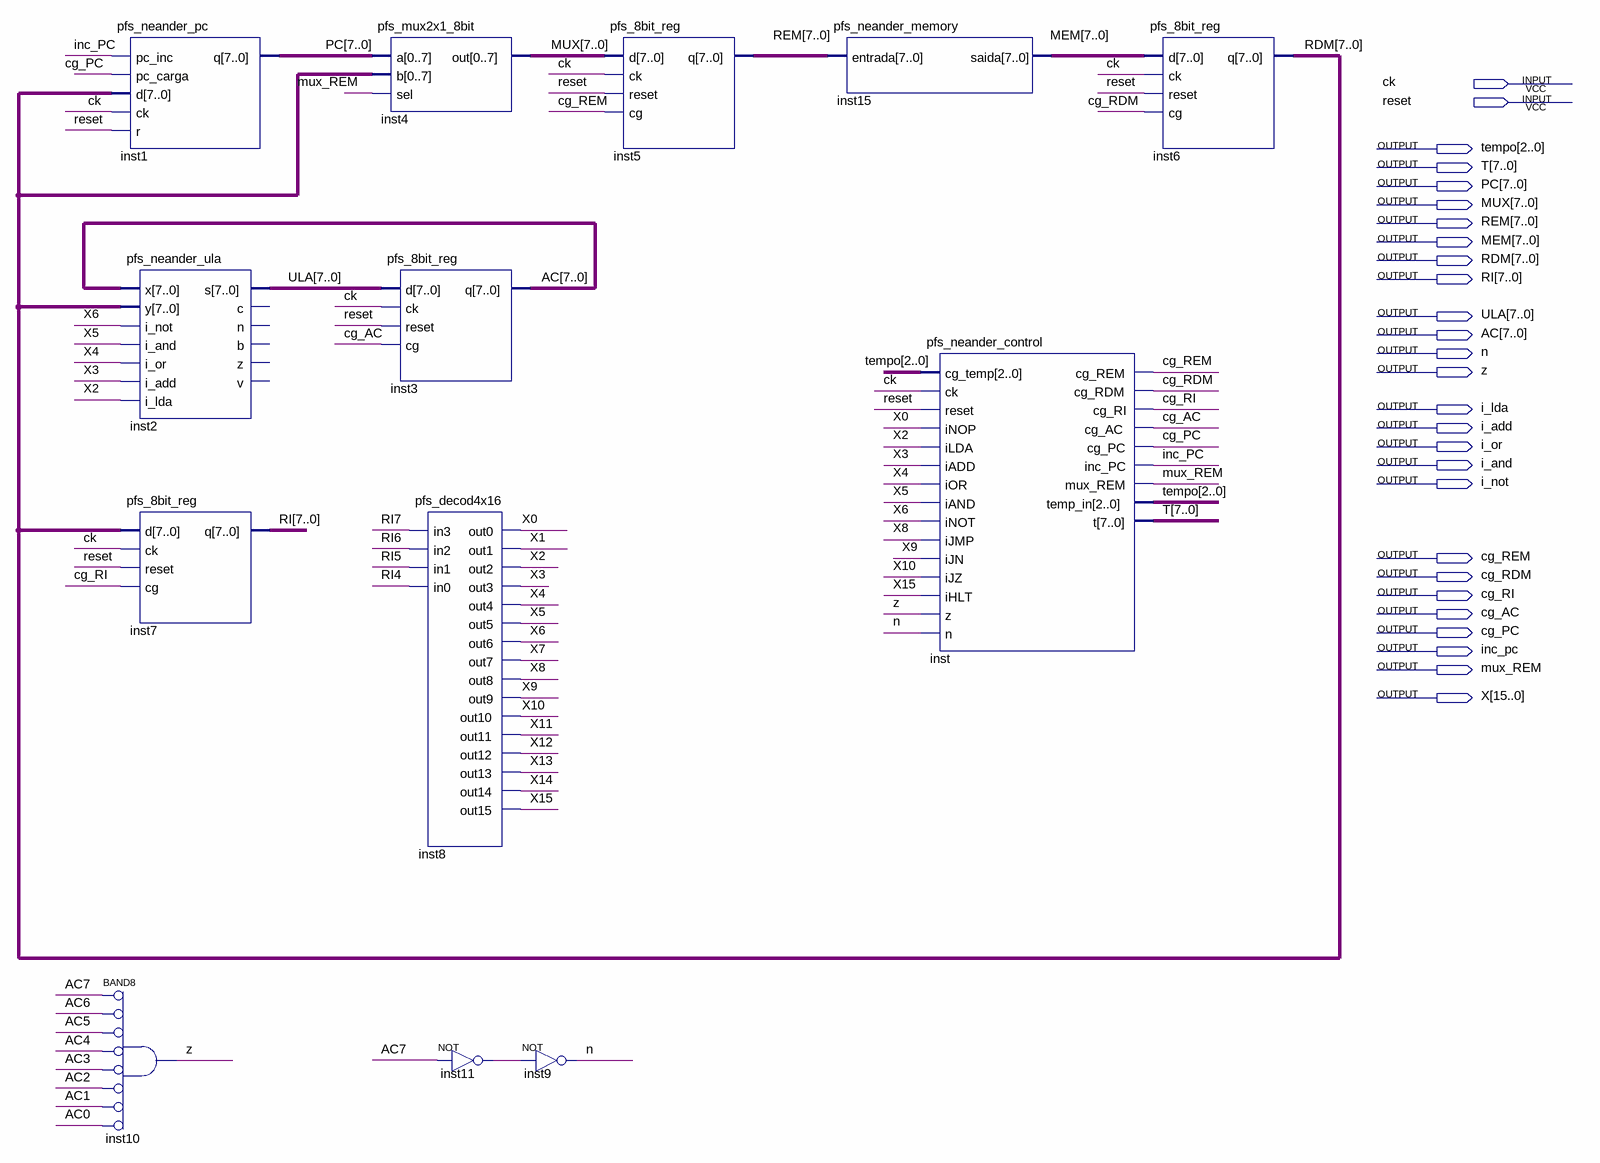
[diagram p0: schematic sheet]
// Quartus schematic pfs_neander.bdf as structural Verilog: 13 symbols, 27 pins
module pfs_neander (
  input  ck,
  input  reset,
  output [2:0] tempo,
  output [7:0] T,
  output [7:0] PC,
  output [7:0] MUX,
  output [7:0] REM,
  output [7:0] MEM,
  output [7:0] RDM,
  output [7:0] RI,
  output [7:0] ULA,
  output [7:0] AC,
  output n,
  output z,
  output i_lda,
  output i_add,
  output i_or,
  output i_and,
  output i_not,
  output cg_REM,
  output cg_RDM,
  output cg_RI,
  output cg_AC,
  output cg_PC,
  output inc_pc,
  output mux_REM,
  output [15:0] X
);

  wire inst11_out;

  pfs_neander_pc inst1 (.pc_inc(inc_pc), .pc_carga(cg_PC), .d(RDM), .ck(ck), .r(reset), .q(PC));
  pfs_neander_ula inst2 (
    .x(AC), .y(RDM), .i_not(X[6]), .i_and(X[5]), .i_or(X[4]), .i_add(X[3]), .i_lda(X[2]), .s(ULA));  // open: c, n, b, z, v
  pfs_8bit_reg inst7 (.d(RDM), .ck(ck), .reset(reset), .cg(cg_RI), .q(RI));
  and inst10 (z, ~AC[7], ~AC[6], ~AC[5], ~AC[4], ~AC[3], ~AC[2], ~AC[1], ~AC[0]);  // BAND8
  pfs_mux2x1_8bit inst4 (.a(PC), .b(RDM), .sel(mux_REM), .out(MUX));
  pfs_8bit_reg inst3 (.d(ULA), .ck(ck), .reset(reset), .cg(cg_AC), .q(AC));
  pfs_decod4x16 inst8 (
    .in3(RI[7]), .in2(RI[6]), .in1(RI[5]), .in0(RI[4]), .out0(X[0]), .out1(X[1]), .out2(X[2]), .out3(X[3]),
    .out4(X[4]), .out5(X[5]), .out6(X[6]), .out7(X[7]), .out8(X[8]), .out9(X[9]), .out10(X[10]),
    .out11(X[11]), .out12(X[12]), .out13(X[13]), .out14(X[14]), .out15(X[15]));
  not inst11 (inst11_out, AC[7]);
  not inst9 (n, inst11_out);
  pfs_8bit_reg inst5 (.d(MUX), .ck(ck), .reset(reset), .cg(cg_REM), .q(REM));
  pfs_neander_memory inst15 (.entrada(REM), .saida(MEM));
  pfs_neander_control inst (
    .cg_temp(tempo), .ck(ck), .reset(reset), .iNOP(X[0]), .iLDA(X[2]), .iADD(X[3]), .iOR(X[4]), .iAND(X[5]),
    .iNOT(X[6]), .iJMP(X[8]), .iJN(X[9]), .iJZ(X[10]), .iHLT(X[15]), .z(z), .n(n), .cg_REM(cg_REM),
    .cg_RDM(cg_RDM), .cg_RI(cg_RI), .cg_AC(cg_AC), .cg_PC(cg_PC), .inc_PC(inc_pc), .mux_REM(mux_REM),
    .temp_in(tempo), .t(T));
  pfs_8bit_reg inst6 (.d(MEM), .ck(ck), .reset(reset), .cg(cg_RDM), .q(RDM));
endmodule
